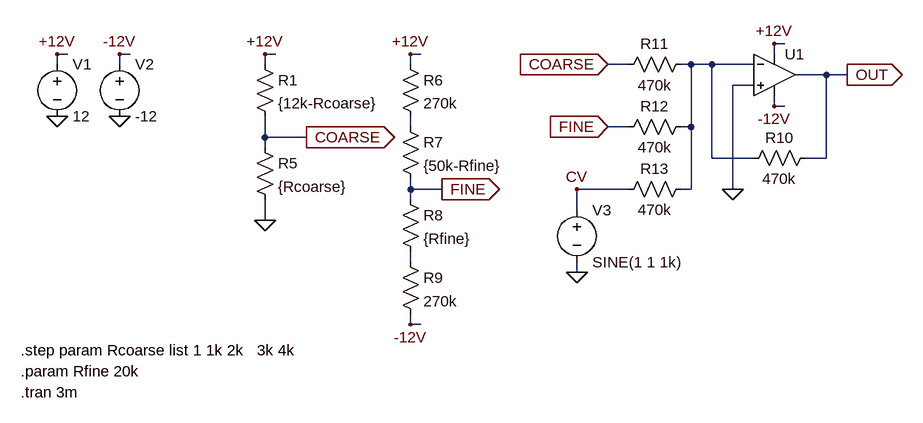
[diagram p0: schematic Antilog_NPNO_Courase_Test_2.asc]
Antilog_NPNO_Courase_Test_2.asc, the LTspice schematic file:
Version 4
SHEET 1 880 680
WIRE 272 -16 256 -16
WIRE -832 0 -848 0
WIRE -736 0 -752 0
WIRE -512 0 -528 0
WIRE -288 0 -304 0
WIRE 256 0 256 -16
WIRE -848 16 -848 0
WIRE -752 16 -752 0
WIRE -528 16 -528 0
WIRE -304 16 -304 0
WIRE 32 16 0 16
WIRE 128 16 112 16
WIRE 160 16 128 16
WIRE 224 16 160 16
WIRE 336 32 288 32
WIRE 368 32 336 32
WIRE 224 48 192 48
WIRE 256 80 256 64
WIRE 272 80 256 80
WIRE -304 112 -304 96
WIRE 32 112 0 112
WIRE 128 112 128 16
WIRE 128 112 112 112
WIRE -528 128 -528 96
WIRE -464 128 -528 128
WIRE -528 144 -528 128
WIRE 160 160 160 16
WIRE 224 160 160 160
WIRE 336 160 336 32
WIRE 336 160 304 160
WIRE -304 208 -304 192
WIRE -256 208 -304 208
WIRE 32 208 -48 208
WIRE 128 208 128 112
WIRE 128 208 112 208
WIRE 192 208 192 48
WIRE -304 224 -304 208
WIRE -48 240 -48 208
WIRE -528 256 -528 224
WIRE -304 320 -304 304
WIRE -48 336 -48 320
WIRE -304 416 -304 400
WIRE -288 416 -304 416
FLAG -528 256 0
FLAG -528 0 +12V
FLAG -464 128 COARSE
IOPIN -464 128 Out
FLAG -848 96 0
FLAG -848 0 +12V
FLAG -304 0 +12V
FLAG -304 416 -12V
FLAG -256 208 FINE
IOPIN -256 208 Out
FLAG -752 96 0
FLAG -752 0 -12V
FLAG 256 -16 +12V
FLAG 256 80 -12V
FLAG 192 208 0
FLAG 368 32 OUT
IOPIN 368 32 Out
FLAG 0 16 COARSE
IOPIN 0 16 In
FLAG 0 112 FINE
IOPIN 0 112 In
FLAG -48 336 0
FLAG -48 208 CV
SYMBOL res -544 0 R0
SYMATTR InstName R1
SYMATTR Value {12k-Rcoarse}
SYMBOL res -544 128 R0
SYMATTR InstName R5
SYMATTR Value {Rcoarse}
SYMBOL voltage -848 0 R0
WINDOW 123 0 0 Left 0
WINDOW 39 0 0 Left 0
SYMATTR InstName V1
SYMATTR Value 12
SYMBOL res -320 0 R0
SYMATTR InstName R6
SYMATTR Value 270k
SYMBOL res -320 96 R0
SYMATTR InstName R7
SYMATTR Value {50k-Rfine}
SYMBOL res -320 208 R0
SYMATTR InstName R8
SYMATTR Value {Rfine}
SYMBOL res -320 304 R0
SYMATTR InstName R9
SYMATTR Value 270k
SYMBOL voltage -752 0 R0
WINDOW 123 0 0 Left 0
WINDOW 39 0 0 Left 0
SYMATTR InstName V2
SYMATTR Value -12
SYMBOL Opamps\\UniversalOpamp2 256 32 R0
SYMATTR InstName U1
SYMBOL res 320 144 R90
WINDOW 0 0 56 VBottom 2
WINDOW 3 32 56 VTop 2
SYMATTR InstName R10
SYMATTR Value 470k
SYMBOL res 128 0 R90
WINDOW 0 0 56 VBottom 2
WINDOW 3 32 56 VTop 2
SYMATTR InstName R11
SYMATTR Value 470k
SYMBOL res 128 96 R90
WINDOW 0 0 56 VBottom 2
WINDOW 3 32 56 VTop 2
SYMATTR InstName R12
SYMATTR Value 470k
SYMBOL res 128 192 R90
WINDOW 0 0 56 VBottom 2
WINDOW 3 32 56 VTop 2
SYMATTR InstName R13
SYMATTR Value 470k
SYMBOL voltage -48 224 R0
WINDOW 123 0 0 Left 0
WINDOW 39 0 0 Left 0
SYMATTR InstName V3
SYMATTR Value SINE(1 1 1k)
TEXT -904 488 Left 2 !.param Rfine 20k
TEXT -904 520 Left 2 !.tran 3m
TEXT -904 456 Left 2 !.step param Rcoarse list 1 1k 2k   3k 4k

The netlist it stands for:
* Antilog_NPNO_Courase_Test_2.asc
R1 +12V COARSE {12k-Rcoarse}
R5 COARSE 0 {Rcoarse}
V1 +12V 0 12
R6 +12V N002 270k
R7 N002 FINE {50k-Rfine}
R8 FINE N003 {Rfine}
R9 N003 -12V 270k
V2 -12V 0 -12
XU1 0 N001 +12V -12V OUT level.2 Avol=1Meg GBW=10Meg Slew=10Meg ilimit=25m rail=0 Vos=0 phimargin=45 en=0 enk=0 in=0 ink=0 Rin=500Meg  ; pins IN+ IN- V+ V- OUT
R10 OUT N001 470k
R11 N001 COARSE 470k
R12 N001 FINE 470k
R13 N001 CV 470k
V3 CV 0 SINE(1 1 1k)
.param Rfine 20k
.tran 3m
.step param Rcoarse list 1 1k 2k   3k 4k
.lib UniversalOpamps2.sub
.backanno
.end